# EAGLE design HeatpumpMonitor (EAGLE 6.5.0)
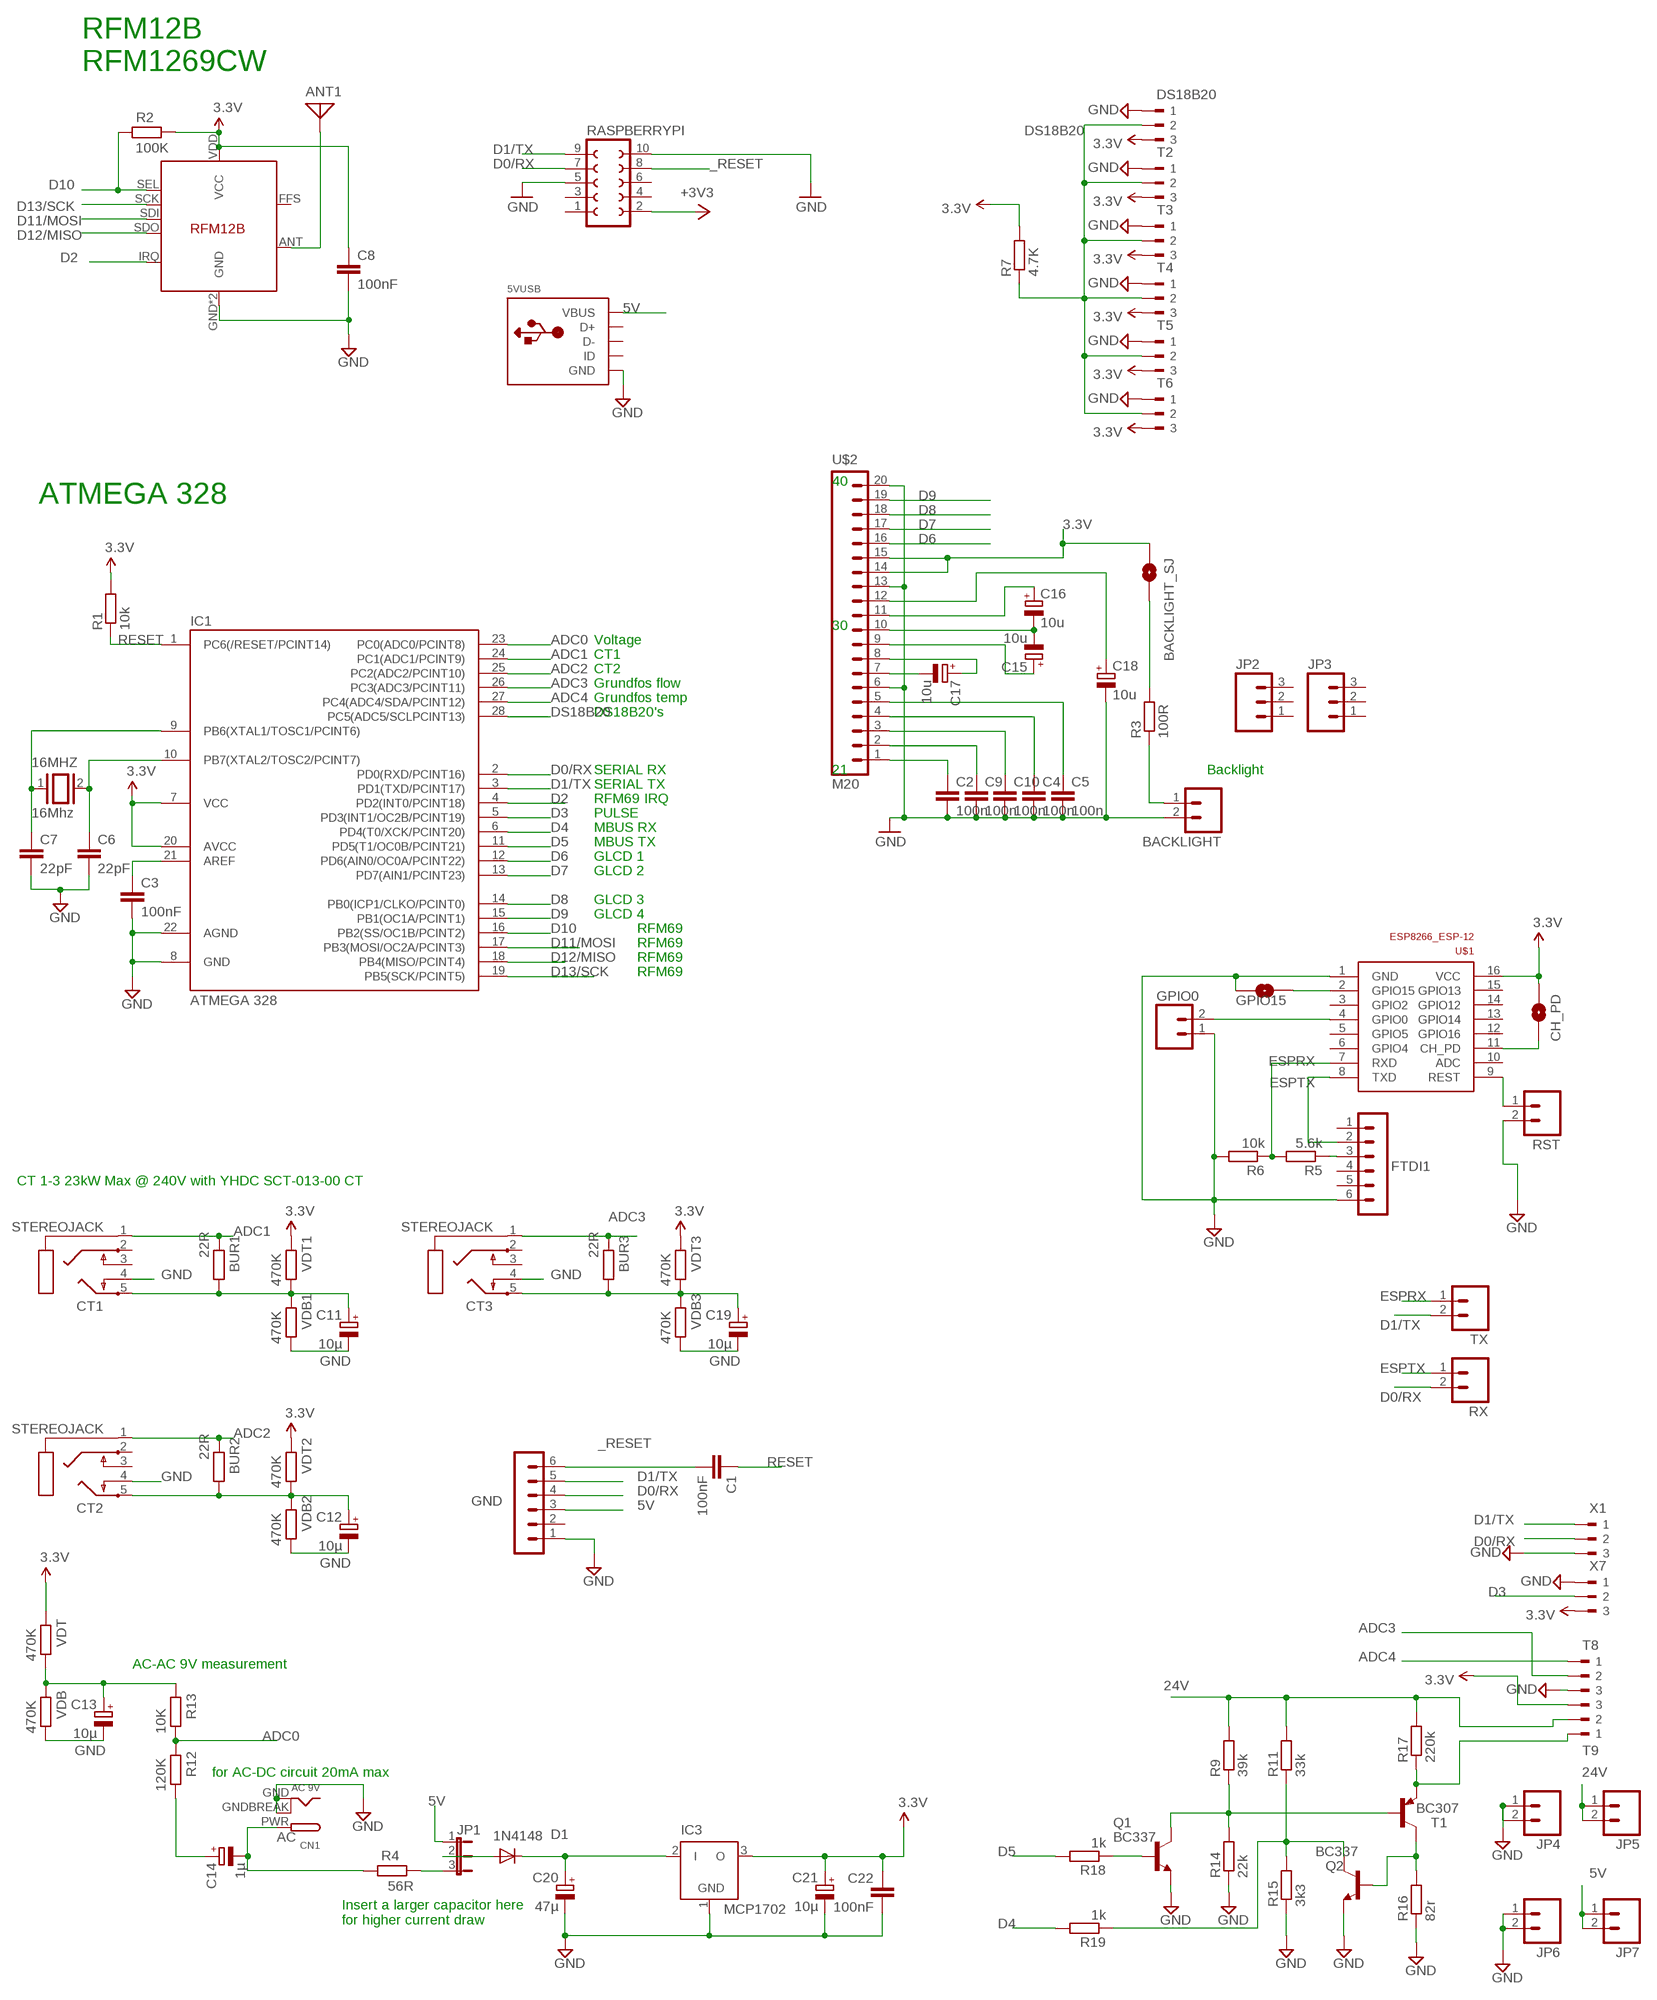
[diagram p0: schematic, sheet 1]

## Parts
5VUSB  USBMOLEX  [USB-MINIB-THM-MOLEX]
16MHZ  16Mhz  XTAL/S  [QS]
ANT1  ANTENNA  [PAD-01]
BACKLIGHT  M02PTH  [1X02]
BACKLIGHT_SJ  SOLDERJUMPERNO  [SJ_2S-NO]
BUR1  22R  R-EU_0204/7  [0204/7]
BUR2  22R  R-EU_0204/7  [0204/7]
BUR3  22R  R-EU_0204/7  [0204/7]
C1  100nF  C-EU025-024X044  [C025-024X044]
C2  100n  C2.5/2  [C2.5-2]
C3  100nF  C-EU025-024X044  [C025-024X044]
C4  100n  C2.5/2  [C2.5-2]
C5  100n  C2.5/2  [C2.5-2]
C6  22pF  C2.5/2  [C2.5-2]
C7  22pF  C2.5/2  [C2.5-2]
C8  100nF  C-EU025-024X044  [C025-024X044]
C9  100n  C2.5/2  [C2.5-2]
C10  100n  C2.5/2  [C2.5-2]
C11  10µ  CPOL-EUE1.8-4  [E1,8-4]
C12  10µ  CPOL-EUE1.8-4  [E1,8-4]
C13  10µ  CPOL-EUE1.8-4  [E1,8-4]
C14  1µ  CPOL-EUE1.8-4  [E1,8-4]
C15  10u  CPOL-EUE1.8-4  [E1,8-4]
C16  10u  CPOL-EUE1.8-4  [E1,8-4]
C17  10u  CPOL-EUE1.8-4  [E1,8-4]
C18  10u  CPOL-EUE1.8-4  [E1,8-4]
C19  10µ  CPOL-EUE1.8-4  [E1,8-4]
C20  47µ  CPOL-EUE1.8-4  [E1,8-4]
C21  10µ  CPOL-EUE1.8-4  [E1,8-4]
C22  100nF  C-EU025-024X044  [C025-024X044]
CH_PD  SOLDERJUMPERNO  [SJ_2S-NO]
CN1  AC 9V  DCBARRELPTH  [DCJACK_2MM_PTH]
CT1  STEREOJACK  [STX3100]
CT2  STEREOJACK  [STX3100]
CT3  STEREOJACK  [STX3100]
D1  1N4148  DIODE1N4148  [DIODE-1N4148]
DS18B20  180-3  [180-3]
FTDI1  FTDI  MA06-1  [MA06-1]
GND  FTDI  MA06-1  [MA06-1]
GPIO0  M02PTH  [1X02]
GPIO15  SOLDERJUMPERNO  [SJ_2S-NO]
IC1  ATMEGA 328  ATMEGA48/88/168-PU  [DIL28-3]
IC3  MCP1702  MCP1702Z  [TO92]
JP1  JP2E  [JP2]
JP2  M03PTH  [1X03]
JP3  M03PTH  [1X03]
JP4  M02PTH  [1X02]
JP5  M02PTH  [1X02]
JP6  M02PTH  [1X02]
JP7  M02PTH  [1X02]
Q1  BC337  [TO92]
Q2  BC337  [TO92]
R1  10k  R-EU_0204/7  [0204/7]
R2  100K  R-EU_0204/7  [0204/7]
R3  100R  R-EU_0204/7  [0204/7]
R4  56R  R-EU_0204/7  [0204/7]
R5  5.6k  R-EU_0204/7  [0204/7]
R6  10k  R-EU_0204/7  [0204/7]
R7  4.7K  R-EU_0204/7  [0204/7]
R9  39k  R-EU_0204/7  [0204/7]
R11  33k  R-EU_0204/7  [0204/7]
R12  120K  R-EU_0204/7  [0204/7]
R13  10K  R-EU_0204/7  [0204/7]
R14  22k  R-EU_0204/7  [0204/7]
R15  3k3  R-EU_0204/7  [0204/7]
R16  82r  R-EU_0204/7  [0204/7]
R17  220k  R-EU_0204/7  [0204/7]
R18  1k  R-EU_0204/7  [0204/7]
R19  1k  R-EU_0204/7  [0204/7]
RASPBERRYPI  FE05-2  [FE05-2]
RST  M02PTH  [1X02]
RX  M02PTH  [1X02]
T1  BC307  [TO92]
T2  180-3  [180-3]
T3  180-3  [180-3]
T4  180-3  [180-3]
T5  180-3  [180-3]
T6  180-3  [180-3]
T8  180-3  [180-3]
T9  180-3  [180-3]
TX  M02PTH  [1X02]
U$1  ESP8266_ESP-12  [ESP8266-ESP12]
U$2  M20  [1X20]
U$14  RFM12B  [RFM12B]
VDB  470K  R-EU_0204/7  [0204/7]
VDB1  470K  R-EU_0204/7  [0204/7]
VDB2  470K  R-EU_0204/7  [0204/7]
VDB3  470K  R-EU_0204/7  [0204/7]
VDT  470K  R-EU_0204/7  [0204/7]
VDT1  470K  R-EU_0204/7  [0204/7]
VDT2  470K  R-EU_0204/7  [0204/7]
VDT3  470K  R-EU_0204/7  [0204/7]
X1  180-3  [180-3]
X7  180-3  [180-3]

## Nets
3.3V: BACKLIGHT_SJ.1 C8.1 C21.+ C22.1 CH_PD.2 DS18B20.3 IC1.7(VCC) IC1.20(AVCC) IC3.3(O) R1.2 R2.1 R7.2 RASPBERRYPI.2 T2.3 T3.3 T4.3 T5.3 T6.3 T9.3 U$1.16(VCC) U$2.14 U$2.15 U$14.VDD(VCC) VDT1.2 VDT2.2 VDT3.2 VDT.2 X7.3 ; supply symbol labelled +3V3
5V [power]: 5VUSB.VBUS GND.3 JP1.1 JP7.1 JP7.2
24V: JP5.1 JP5.2 R9.2 R11.2 R17.2 T9.2
_RESET: C1.2 GND.6 RASPBERRYPI.8
AC: C14.- CN1.PWR R4.2
ADC0: IC1.23(PC0(ADC0/PCINT8)) R12.2 R13.1
ADC1: BUR1.2 CT1.1 IC1.24(PC1(ADC1/PCINT9))
ADC2: BUR2.2 CT2.1 IC1.25(PC2(ADC2/PCINT10))
ADC3: BUR3.2 CT3.1 IC1.26(PC3(ADC3/PCINT11)) T8.2
ADC4: IC1.27(PC4(ADC4/SDA/PCINT12)) T8.1
D0/RX: GND.4 IC1.2(PD0(RXD/PCINT16)) RASPBERRYPI.7 RX.2 X1.2
D1/TX: GND.5 IC1.3(PD1(TXD/PCINT17)) RASPBERRYPI.9 TX.2 X1.1
D2: IC1.4(PD2(INT0/PCINT18)) U$14.IRQ
D3: IC1.5(PD3(INT1/OC2B/PCINT19)) X7.2
D4: IC1.6(PD4(T0/XCK/PCINT20)) R19.2
D5: IC1.11(PD5(T1/OC0B/PCINT21)) R18.2
D6: IC1.12(PD6(AIN0/OC0A/PCINT22)) U$2.16
D7: IC1.13(PD7(AIN1/PCINT23)) U$2.17
D8: IC1.14(PB0(ICP1/CLKO/PCINT0)) U$2.18
D9: IC1.15(PB1(OC1A/PCINT1)) U$2.19
D10: IC1.16(PB2(SS/OC1B/PCINT2)) R2.2 U$14.SEL
D11/MOSI: IC1.17(PB3(MOSI/OC2A/PCINT3)) U$14.SDI
D12/MISO: IC1.18(PB4(MISO/PCINT4)) U$14.SDO
D13/SCK: IC1.19(PB5(SCK/PCINT5)) U$14.SCK
DIG1: ANT1.1 U$14.ANT
DS18B20: DS18B20.2 IC1.28(PC5(ADC5/SCLPCINT13)) R7.1 T2.2 T3.2 T4.2 T5.2 T6.2
ESPRX: R5.2 R6.1 TX.1 U$1.7(RXD)
ESPTX: FTDI1.2 RX.1 U$1.8(TXD)
GND [power]: 5VUSB.GND BACKLIGHT.2 C2.2 C3.2 C4.2 C5.2 C6.2 C7.2 C8.2 C9.2 C10.2 C11.- C12.- C13.- C18.- C19.- C20.- C21.- C22.2 CN1.GND CN1.GNDBREAK CT1.4 CT2.4 CT3.4 DS18B20.1 FTDI1.6 GND.1 GPIO0.1 GPIO15.2 IC1.8(GND) IC1.22(AGND) IC3.1(GND) JP4.1 JP4.2 JP6.1 JP6.2 Q1.1(E) Q2.1(E) R6.2 R14.1 R15.1 R16.1 RASPBERRYPI.5 RASPBERRYPI.10 RST.2 T2.1 T3.1 T4.1 T5.1 T6.1 T8.3 U$1.1(GND) U$2.6 U$2.13 U$2.20 U$14.GND U$14.P$12(GND) VDB1.1 VDB2.1 VDB3.1 VDB.1 X1.3 X7.1
IRQ: BACKLIGHT_SJ.2 R3.2
N$1: 16MHZ.2 C6.1 IC1.10(PB7(XTAL2/TOSC2/PCINT7))
N$2: BUR2.1 C12.+ CT2.5 VDB2.2 VDT2.1
N$3: C2.1 U$2.1
N$4: C9.1 U$2.2
N$5: C10.1 U$2.3
N$6: C4.1 U$2.4
N$7: C14.+ R12.1
N$8: BUR3.1 C19.+ CT3.5 VDB3.2 VDT3.1
N$9: C5.1 U$2.5
N$10: C15.- C16.- U$2.10
N$11: C20.+ D1.C IC3.2(I)
N$12: 16MHZ.1 C7.1 IC1.9(PB6(XTAL1/TOSC1/PCINT6))
N$13: R17.1 T1.1(E) T9.1
N$14: JP1.3 R4.1
N$16: Q2.2(B) R16.2 T1.3(C)
N$17: BACKLIGHT.1 R3.1
N$18: Q1.3(C) R9.1 R14.2 T1.2(B)
N$19: C3.1 IC1.21(AREF)
N$20: C16.+ U$2.11
N$21: Q2.3(C) R11.1 R15.2 R19.1
N$22: C15.+ U$2.9
N$23: C17.- U$2.7
N$24: D1.A JP1.2
N$25: Q1.2(B) R18.1
N$26: GPIO15.1 U$1.2(GPIO15)
N$27: C17.+ U$2.8
N$28: C18.+ U$2.12
N$29: GPIO0.2 U$1.4(GPIO0)
N$34: C13.+ R13.2 VDB.2 VDT.1
N$36: FTDI1.3 R5.1
N$38: BUR1.1 C11.+ CT1.5 VDB1.2 VDT1.1
N$39: CH_PD.1 U$1.11(CH_PD)
N$40: RST.1 U$1.9(REST)
RESET: C1.1 IC1.1(PC6(/RESET/PCINT14)) R1.1
Unconnected: 5VUSB.D+ 5VUSB.D- 5VUSB.ID CT1.2 CT1.3 CT2.2 CT2.3 CT3.2 CT3.3 FTDI1.1 FTDI1.4 FTDI1.5 GND.2 JP2.1 JP2.2 JP2.3 JP3.1 JP3.2 JP3.3 RASPBERRYPI.1 RASPBERRYPI.3 RASPBERRYPI.4 RASPBERRYPI.6 U$1.3(GPIO2) U$1.5(GPIO5) U$1.6(GPIO4) U$1.10(ADC) U$1.12(GPIO16) U$1.13(GPIO14) U$1.14(GPIO12) U$1.15(GPIO13) U$14.FFS

## Notes on the sheet
- RFM12B
  RFM1269CW
- 40
- ATMEGA 328
- 30
- Voltage
- CT1
- CT2
- Grundfos flow
- Grundfos temp
- DS18B20's
- SERIAL RX | 21 | Backlight
- SERIAL TX
- RFM69 IRQ
- PULSE
- MBUS RX
- MBUS TX
- GLCD 1
- GLCD 2
- GLCD 3
- GLCD 4
- RFM69
- RFM69
- RFM69
- RFM69
- CT 1-3 23kW Max @ 240V with YHDC SCT-013-00 CT
- AC-AC 9V measurement
- for AC-DC circuit 20mA max
- Insert a larger capacitor here
  for higher current draw

## Library data of the parts
5VUSB = adafruit:USB: USB Connectors USBMINIB - Surface Mount Female Mini-B USB Connector 4UConnector: 06564 By microbuilder.eu Thru-hole RA Female Mini-B USB Connector 4UConnector: 18732 By ladyada.net
16MHZ = special:XTAL/S: CRYSTAL
ANT1 = discrete:ANTENNA: Antenna
BACKLIGHT GPIO0 JP4-JP7 RST RX TX = SparkFun:M02: Header 2 Standard 2-pin 0.1" header. Use with straight break away headers (SKU : PRT-00116), right angle break away headers (PRT-00553), swiss pins (PRT-00743), machine pins (PRT-00117), and female headers (PRT-00115). Molex polarized connector foot print use with SKU : PRT-08233 with associated crimp pins and housings.
BACKLIGHT_SJ CH_PD GPIO15 = SparkFun:SOLDERJUMPER: Solder Jumper Standard SMD solder jumper. Used to automate production. Two varients : Normally Open and Normally Closed are the same, but have different paste layers. NC will have a large amount of paste and should jumper during reflow.
BUR1-BUR3 R2-R6 R12 R13 VDB VDB1-VDB3 VDT VDT1-VDT3 = rcl:R-EU_: RESISTOR, European symbol
C1 C3 C8 C22 = resistor:C-EU: CAPACITOR, European symbol
C2 C4-C7 C9 C10 = capacitor-wima:C: CAPACITOR naming: grid - package width
C11-C21 = resistor:CPOL-EU: POLARIZED CAPACITOR, European symbol
CN1 = adafruit:DCBARREL: 2.0mm DC Barrel Jack DCJACK_2MM_PTH - Through Hole Jack (4UConnector: 05537)
CT1-CT3 = adafruit:STEREOJACK: MIC/HEADPHONE JACK Stereo jack with two switches. Kycon STX3100, CUI SJ1-3555NG and/or 4UCon 05544
D1 = SparkFun:DIODE: Diode These are standard reverse protection diodes and small signal diodes. SMA package can handle up to about 1A. SOD-323 can handle about 200mA. What the SOD-323 package when ordering, there are some mfgs out there that are 5-pin packages.
DS18B20 T2-T6 T8 T9 X1 X7 = con-weidmueller-sl35:180-3: WEIDMUELLER CLAMP CONNECTOR; OC_FARNELL: unknown; OC_NEWARK: unknown
FTDI1 GND = JeeLabs:MA06-1: PIN HEADER
IC1 = atmega8:ATMEGA48/88/168-PU
IC3 = JeeLabs:MCP1702: 200 mA, Low Power Low Dropout Voltage Regulator
JP1 = jumper:JP2E: JUMPER
JP2 JP3 = SparkFun:M03: Header 3 Standard 3-pin 0.1" header. Use with straight break away headers (SKU : PRT-00116), right angle break away headers (PRT-00553), swiss pins (PRT-00743), machine pins (PRT-00117), and female headers (PRT-00115). Molex polarized connector foot print use with SKU : PRT-08232 with associated crimp pins and housings.
Q1 Q2 = transistor:BC337: NPN TRANSISTOR
R1 R7 R9 R11 R14-R19 = resistor:R-EU_: RESISTOR, European symbol
RASPBERRYPI = con-lsta:FE05-2: FEMALE HEADER; OC_FARNELL: unknown; OC_NEWARK: unknown
T1 = transistor-pnp:BC307: PNP Transistor
U$1 = ESP8266-ESP12:ESP8266_ESP-12
U$2 = SparkFun:M20: This is just like the LOCK variant in that the holes are staggared by 5 mil, but except for the last two holes. They are not altered from the "standard" footprint layout. This is used for a special purpose on the layout of our Graphic LCD Backpack. Make sure you want to use this device before selecting it for you project!
U$14 = JeeParts:RFM12B

## Net classes
0 default: width 0.203 mm, drill 0.6 mm, clearance 0.203 mm
1 power: width 0.381 mm, drill 0.6 mm, clearance 0.254 mm
2 gnd: width 0.254 mm, drill 0.6 mm, clearance 0.254 mm

## Board
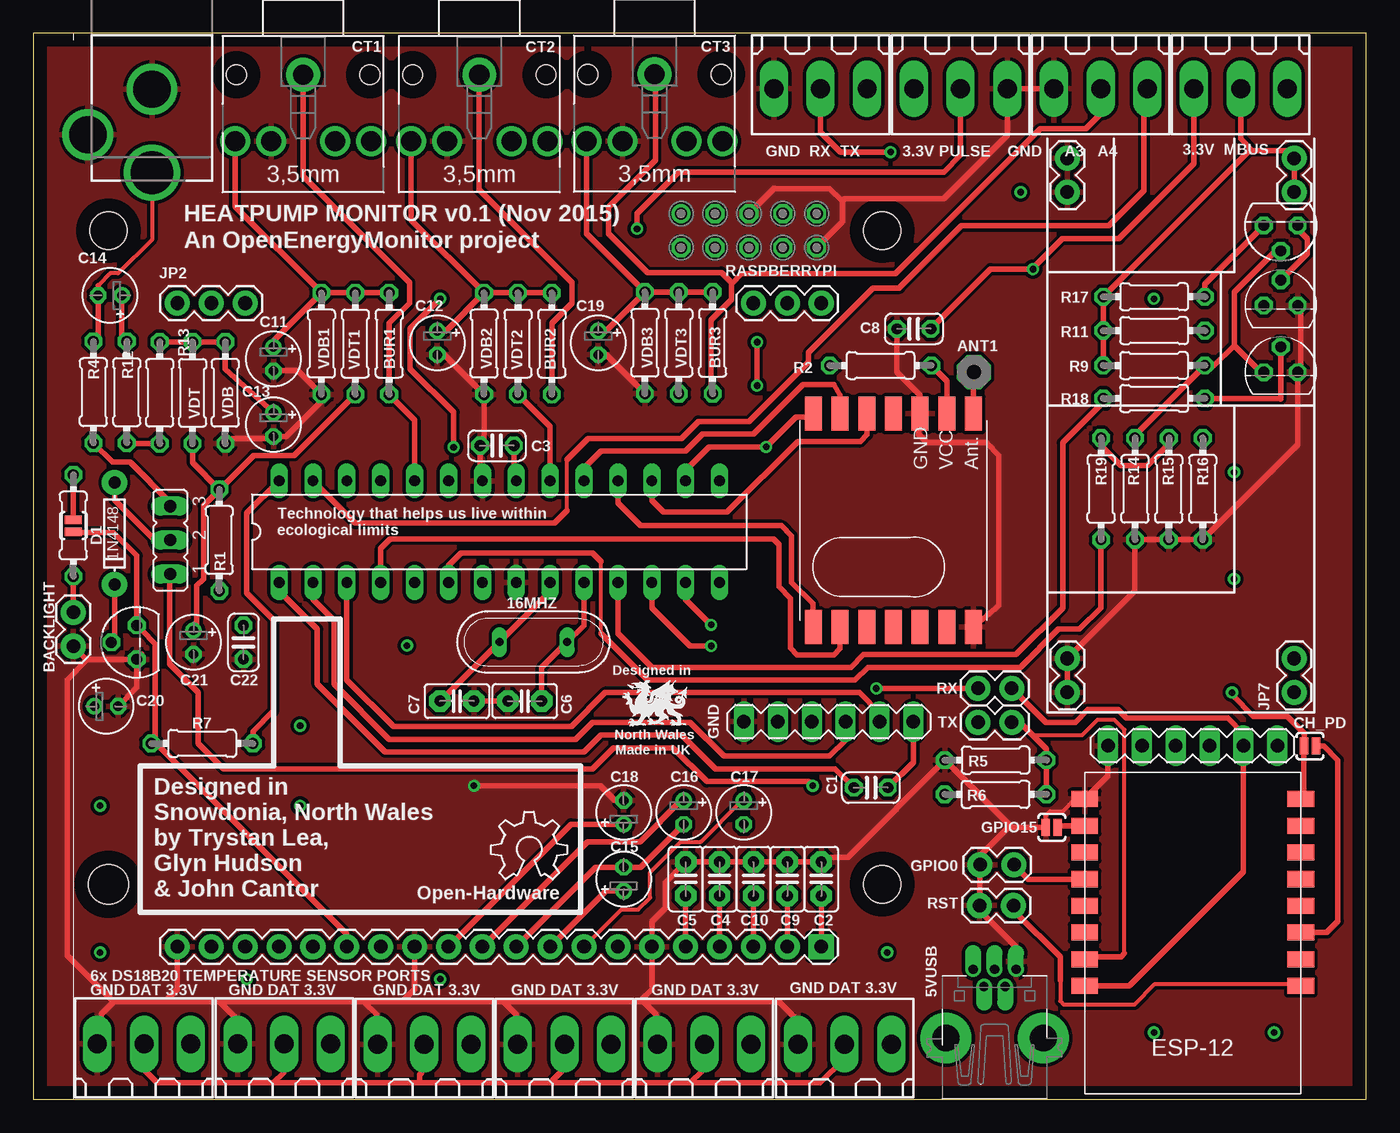
[diagram p1: board, top side]
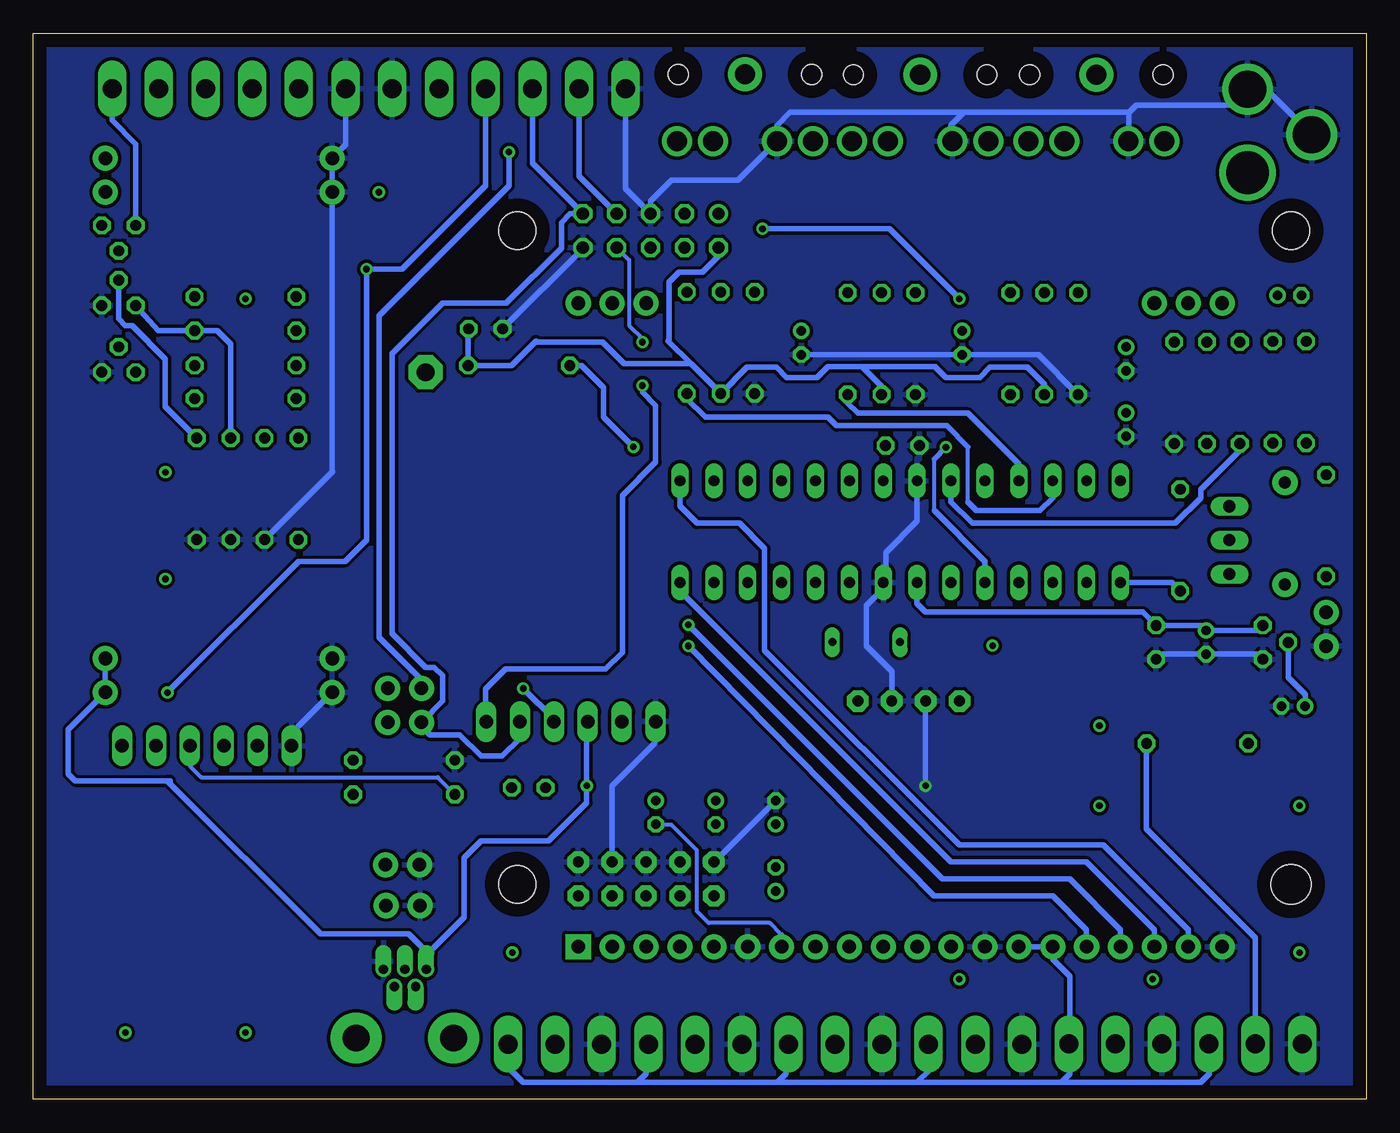
[diagram p2: board, bottom side, seen from below]

Size 99.9 x 79.9 mm. Coordinates in mm from the lower left corner, seen from the top.
Outline: 99.9,0 99.9,79.9 0,79.9 0,0 99.9,0
Copper layers (1*16): Top 0.035mm / dielectric 1.5mm / Bottom 0.035mm
Design rules "default *": minimum track width 10mil, minimum drill 24mil, track to track 8mil, track to pad 8mil, pad to pad 8mil, via to via 8mil, smd to smd 8mil, copper to edge 40mil, drill to drill 8mil, minimum pad ring 10mil, minimum via ring 8mil, stop-mask expansion 0.075mm, vias tented up to drill 0.6mm, thermal gap 10mil
Holes 2.8 mm at 63.63,16.11 63.63,65.11 5.63,65.11
Holes 3 mm at 5.63,16.11

### Footprints (pad centres in the part's own frame; a part is rotated, then mirrored left to right if it is on the bottom)
USB-MINIB-THM-MOLEX = drill 0.7 offset: D+ 0,9.72; D- -0.8,8.42; GND 1.6,9.72; ID 0.8,8.42; VBUS -1.6,9.72 | drill 2 pad 3.81: GND1 -3.65,4.57; GND4 3.65,4.57
QS = drill 0.61 long: 1 -2.54,0; 2 2.54,0
PAD-01 = drill 1.321 pad 2.54 octagon: 1 0,0
1X02 = drill 1.016 pad 1.88: 1 0,0; 2 2.54,0
SJ_2S-NO = smd 0.635 x 1.27: 1 -0.45,0; 2 0.45,0
0204/7 = drill 0.813 octagon: 1 -3.81,0; 2 3.81,0
C025-024X044 = drill 0.813 octagon: 1 -1.27,0; 2 1.27,0
C2.5-2 = drill 0.813 pad 1.6 octagon: 1 -1.27,0; 2 1.27,0
E1,8-4 = drill 0.711 pad 1.168: + -0.889,0 | drill 0.711 pad 1.168 octagon: - 0.889,0
DCJACK_2MM_PTH = drill 2.8: GND 0,7.35; GNDBREAK 4.8,10.75 | drill 3.2: PWR 0,13.6
STX3100 = drill 1.5 pad 2.54: 1 2.7,-0.1 | drill 1.5: 2 7.7,5; 3 7.7,2.3; 4 7.7,-2.5; 5 7.7,-5.2 | hole 1.5: 2.7,4.9; 2.7,-5.1
DIODE-1N4148 = drill 0.9 pad 1.88: A -3.81,0; C 3.81,0
180-3 = drill 1.422 long: 1 -3.5,0; 2 0,0; 3 3.5,0
MA06-1 = drill 1.016 long: 1 0,0; 2 2.54,0; 3 5.08,0; 4 7.62,0; 5 10.16,0; 6 12.7,0
DIL28-3 = drill 0.813 long: 1 -16.51,-3.81; 2 -13.97,-3.81; 3 -11.43,-3.81; 4 -8.89,-3.81; 5 -6.35,-3.81; 6 -3.81,-3.81; 7 -1.27,-3.81; 8 1.27,-3.81; 9 3.81,-3.81; 10 6.35,-3.81; 11 8.89,-3.81; 12 11.43,-3.81; 13 13.97,-3.81; 14 16.51,-3.81; 15 16.51,3.81; 16 13.97,3.81; 17 11.43,3.81; 18 8.89,3.81; 19 6.35,3.81; 20 3.81,3.81; 21 1.27,3.81; 22 -1.27,3.81; 23 -3.81,3.81; 24 -6.35,3.81; 25 -8.89,3.81; 26 -11.43,3.81; 27 -13.97,3.81; 28 -16.51,3.81
TO92 = drill 0.813 octagon: 1 -1.27,0; 2 0,1.905; 3 1.27,0
JP2 = drill 0.914 long: 1 -2.54,0; 2 0,0; 3 2.54,0
1X03 = drill 1.016 pad 1.88: 1 0,0; 2 2.54,0; 3 5.08,0
TO92' = drill 0.813 octagon: 1 1.27,0; 2 0,1.905; 3 -1.27,0
FE05-2 = drill 0.914: 1 -5.08,1.27 | drill 0.914 octagon: 2 -5.08,-1.27; 3 -2.54,1.27; 4 -2.54,-1.27; 5 0,1.27; 6 0,-1.27; 7 2.54,1.27; 8 2.54,-1.27; 9 5.08,1.27; 10 5.08,-1.27
ESP8266-ESP12 = smd 2 x 1.2: 1 16.2,2; 2 16.2,4; 3 16.2,6; 4 16.2,8; 5 16.2,10; 6 16.2,12; 7 16.2,14; 8 16.2,16; 9 0,16; 10 0,14; 11 0,12; 12 0,10; 13 0,8; 14 0,6; 15 0,4; 16 0,2
1X20 = drill 1.016 pad 1.88 square: 1 0,0 | drill 1.016 pad 1.88: 2 2.54,0; 3 5.08,0; 4 7.62,0; 5 10.16,0; 6 12.7,0; 7 15.24,0; 8 17.78,0; 9 20.32,0; 10 22.86,0; 11 25.4,0; 12 27.94,0; 13 30.48,0; 14 33.02,0; 15 35.56,0; 16 38.1,0; 17 40.64,0; 18 43.18,0; 19 45.72,0; 20 48.26,0
RFM12B = smd 2.54 x 1.27: ANT 8,-6; FFS -8,2; GND 8,-2; IRQ -8,4; P$8 -8,0; P$9 -8,-2; P$10 -8,-4; P$12 -8,-6; P$16 8,0; SCK 8,4; SDI 8,2; SDO -8,6; SEL 8,6; VDD 8,-4

### Placement (x,y rotation side)
5VUSB  72.05,0.02 0 top
16MHZ  37.48,34.27 0 top
ANT1  70.5,54.5 270 top
BACKLIGHT  3,36.5 270 top
BACKLIGHT_SJ  3,43 90 top
BUR1  26.67,56.64 270 top
BUR2  38.86,56.64 270 top
BUR3  50.91,56.7 270 top
C1  62.78,23.36 0 top
C2  59.05,16.51 90 top
C3  34.75,49 180 top
C4  51.44,16.51 90 top
C5  48.9,16.51 90 top
C6  36.83,29.84 180 top
C7  31.75,29.84 0 top
C8  66,57.75 180 top
C9  56.52,16.51 90 top
C10  53.98,16.51 90 top
C11  18,55.5 270 top
C12  30.28,56.7 270 top
C13  18,50.57 270 top
C14  5.75,60.25 180 top
C15  44.25,16.5 90 top
C16  48.75,21.5 270 top
C17  53.25,21.5 270 top
C18  44.25,21.5 90 top
C19  42.34,56.7 270 top
C20  5.46,29.46 0 top
C21  12,34.25 270 top
C22  15.75,34.25 270 top
CH_PD  95.69,26.47 180 top
CN1  8.89,83.06 180 top
CT1  20.32,79.5 270 top
CT2  33.53,79.5 270 top
CT3  46.66,79.53 270 top
D1  6.08,42.41 270 top
DS18B20  8.3,4.15 0 top
FTDI1  93.25,26.5 180 top
GND  53.26,28.3 0 top
GPIO0  70.96,17.58 0 top
GPIO15  76.34,20.38 180 top
IC1  34.92,42.55 0 top
IC3  7.75,34.25 90 top
JP1  10.26,41.91 90 top
JP2  10.79,59.68 0 top
JP3  53.98,59.68 0 top
JP4  77.5,68 90 top
JP5  94.5,68 90 top
JP6  77.5,30.5 90 top
JP7  94.5,30.5 90 top
LOGO1  OSHW_LOGO_6MILX0200-NT  [OSHW_6X200_NOTEXT]  34.33,16.47 0 top
Q1  BC337  [TO92']  93.5,54.5 0 top
Q2  BC337  [TO92']  93.5,59.5 0 top
R1  13.94,41.91 90 top
R2  63.5,55 180 top
R3  3,43 90 top
R4  4.5,53 90 top
R5  72.12,22.85 0 top
R6  72.12,25.42 180 top
R7  12.65,26.67 180 top
R9  84,55 180 top
R11  84,57.62 180 top
R12  7,53 270 top
R13  9.47,52.95 90 top
R14  82.58,45.76 90 top
R15  85.11,45.76 90 top
R16  87.66,45.76 90 top
R17  84,60.16 180 top
R18  84,52.53 180 top
R19  80.03,45.76 270 top
RASPBERRYPI  53.63,65.11 0 top
RST  73.46,14.52 180 top
RX  73.34,30.8 180 top
T1  BC307  [TO92']  93.5,65.5 180 top
T2  18.8,4.15 0 top
T3  29.3,4.13 0 top
T4  39.8,4.13 0 top
T5  50.3,4.13 0 top
T6  60.8,4.13 0 top
T8  80,75.75 180 top
T9  90.5,75.75 180 top
TX  73.34,28.26 180 top
U$1  95,24.5 180 top
U$2  59.05,11.43 180 top
U$14  64.47,43.39 90 top
VDB  14.39,52.95 90 top
VDB1  21.59,56.64 90 top
VDB2  33.78,56.64 90 top
VDB3  45.84,56.7 90 top
VDT  11.93,52.95 270 top
VDT1  24.13,56.64 270 top
VDT2  36.32,56.64 270 top
VDT3  48.38,56.7 270 top
X1  59,75.75 180 top
X7  69.5,75.75 180 top

### Tracks (layer width: path | path; a pad name or v marks a point on that pad's centre or on a via)
3.3V  (via drill 0.5)
  Top 0.406: 94.74,22.61 95,22.61 U$1.16 arc90 U$1.16 95.24,22.74 CH_PD.2 95.25,26.49 95.25,27.43 93.98,28.7 91.44,28.7 89.85,30.29 v89.85,30.48 | BACKLIGHT_SJ.1 3.05,42.5 6,42.5 7.75,40.75 IC3.3 8.13,35.14 8.14,35.14 9.14,34.14 9.14,26.98 R7.2 9.21,26.67 23.5,12.38 U$2.15 | R1.2 11.93,47.73 VDT.2 | R1.2 13.97,45.75 14,45.75 12.75,44.5 12.75,39 12.25,38.5 12.25,35.39 C21.+ | VDT2.2 38.73,50.42 IC1.20 | R2.1 68.47,53.84 U$14.VDD 68.54,51.08 68.58,51.12 | VDT1.2 19.56,48.26 16.51,48.26 13.97,45.72 R1.2 | C8.1 71.75,62.23 v74.93,62.23 74.93,62.3 77.12,64.5 81.38,64.5 87,70.12 T9.3
  Bottom 0.406: VDT1.2 24.13,53.59 25.4,54.86 28.19,54.86 28.96,54.1 31.5,54.1 32.32,54.93 37.78,54.93 | U$2.14 U$2.15 23.5,10.48 22.23,9.21 22.23,4.22 T2.3 22.23,4.08 22.23,1.91 22.86,1.27 | DS18B20.3 11.75,4.1 11.75,1.91 12.38,1.27 22.86,1.27 | 22.86,1.27 33.66,1.27 | 33.66,1.27 44.13,1.27 | 44.13,1.27 54.61,1.27 | 54.61,1.27 63.18,1.27 64.14,2.22 64.14,3.96 T6.3 | T3.3 32.7,4.03 32.7,2.22 33.66,1.27 | T4.3 43.5,3.93 43.5,1.91 44.13,1.27 | T5.3 53.98,3.96 53.98,1.91 54.61,1.27 | 37.78,54.93 40.32,54.93 41.15,54.1 43.43,54.1 44.2,54.86 46.41,54.86 VDT3.2 50.62,55.13 | 37.78,54.93 36.32,53.47 VDT2.2 | 50.62,55.13 52.31,56.83 52.25,56.9 52.25,61.25 51.5,62 49.75,62 48.55,63.2 RASPBERRYPI.2 | C8.1 67.31,57.71 R2.1 64.06,55 62.23,56.83 62.15,56.75 57.25,56.75 55.63,55.13 50.62,55.13 | v89.85,30.48 80.01,40.32 76.52,40.32 74.93,41.91 v74.93,62.23 72.25,62.23 66,68.48 X7.3 | IC1.7 33.66,37.15 33.02,36.51 16.74,36.51 C22.1 12.38,35.52 C21.+ 8.13,35.14 IC3.3
5V  (via drill 0.5)
  Top 0.406: v58.42,23.5 58.1,23.81 50.48,23.81 47.94,26.35 43.5,26.35 41.91,24.77 14.25,24.77 12.34,26.67 12.34,30.48 10.21,32.61 10.21,39.33 JP1.1
  Bottom 0.406: 89.85,23.88 96.77,23.88 97.28,24.38 97.28,27.72 JP7.1 JP7.2 | 89.85,23.88 89.66,23.88 | JP1.1 10.16,39.27 | GND.3 58.42,28.23 v58.42,23.5 58.42,22.23 61.28,19.37 66.36,19.37 67.63,18.1 67.63,13.62 70.45,10.79 | 70.45,10.79 70.45,11.08 71.75,12.38 78.36,12.38 89.85,23.88 | 70.45,10.79 5VUSB.VBUS
24V
  Top 0.406: R9.2 R11.2 R17.2 91.16,71.11 91.38,71.11 | JP5.1 JP5.2 93.92,71.11 91.38,71.11 | 91.38,71.11 90.5,71.99 T9.2
_RESET  (via drill 0.5)
  Top 0.406: GND.6 65.95,25.26 C1.2 | v54.25,53.5 v54.25,56.75
  Bottom 0.305: RASPBERRYPI.8 55.25,62.91 55.25,58 54.25,57
  Bottom 0.406: GND.6 66,28.34 66,30.75 64.5,32.25 57,32.25 55.75,33.5 55.75,45.25 53.25,47.75 53.25,52 54.25,53 v54.25,53.5 | 54.25,57 v54.25,56.75
AC
  Top 0.305: CN1.PWR 8.89,64.45 6.35,61.91 5.78,61.91 4.86,60.99
  Top 0.406: 4.86,60.99 C14.- 4.86,57.17 R4.2
ADC0
  Top 0.406: R12.2 7.04,49.15 R13.1 9.39,49.15 9.25,49
  Bottom 0.406: R13.1 9.53,49.09 9.53,48.58 12.38,45.72 12.38,45.09 14.29,43.18 29.53,43.18 31.11,44.77 IC1.23 31.11,45.4
ADC1
  Top 0.406: CT1.1 20.22,69.19 28.19,61.21 28.19,59.69 26.67,58.17 BUR1.2 28.57,50.93 IC1.24
ADC2
  Top 0.406: BUR2.2 38.86,58.17 40.39,59.69 40.39,61.21 33.43,68.17 CT2.1
  Bottom 0.406: IC1.25 26.04,47.62 29.84,51.44 38.1,51.44 38.86,52.2 BUR2.2 38.86,52.51
ADC3
  Top 0.406: 52.32,61.11 52.32,61.21 51.56,61.98 46.02,61.98 43.12,64.88 43.12,66.88 46.62,70.38 46.62,76.76 CT3.1 46.66,76.83 | 52.32,61.11 52.32,59.94 50.8,58.42 50.8,53.01 BUR3.2 | 52.32,61.11 53.09,61.87 64.62,61.87 75.49,72.75 78.88,72.75 80,73.88 T8.2
  Bottom 0.305: 29.84,44.77 29.84,48.9
  Bottom 0.406: IC1.26 23.5,45.09 24.45,44.13 29.21,44.13 29.84,44.77 | 29.84,48.9 31.43,50.48 39.69,50.48 40.32,51.12 49.53,51.12 50.91,52.5 BUR3.2
ADC4
  Top 0.305: 40.01,44.13 40.01,47.94
  Top 0.406: IC1.27 24.13,43.18 39.05,43.18 40.01,44.13 | 40.01,47.94 41.59,49.53 48.58,49.53 49.85,50.8 53.66,50.8 58.1,55.24 58.1,55.97 62.94,60.81 64.88,60.81 | 64.88,60.81 64.92,60.81 | 64.88,60.81 69.57,65.5 80.62,65.5 83.25,68.12 83.25,74.89 83.5,75.14 T8.1
D0/RX  (via drill 0.5)
  Top 0.406: IC1.2 20.95,37.47 22.54,35.88 22.54,31.11 26.67,26.99 40.64,26.99 41.91,28.26 49.21,28.26 51.75,25.72 59.69,25.72 60.88,26.91 GND.4 | RX.2 v63.18,30.8 | X1.2 59,72.5 60.5,71 v64.25,71
  Bottom 0.406: 60.88,28.82 GND.4 60.88,28.5 v63.18,30.8 | RX.2 70.8,31.43 73.98,34.61 73.98,58.74 64.25,68.47 v64.25,71 | RASPBERRYPI.7 59,69.2 X1.2
D1/TX
  Top 0.406: IC1.3 23.5,31.43 26.99,27.94 40.32,27.94 42.86,30.48 61.91,30.48 63.42,28.97 GND.5
  Bottom 0.406: GND.5 63.42,27.07 64.77,25.72 66.36,25.72 67.94,27.3 70.17,27.3 70.8,27.94 TX.2 69.22,29.84 69.22,31.75 69.85,32.38 70.48,32.38 73.03,34.92 73.03,55.88 69.22,59.69 64.45,59.69 60.33,63.82 60.33,65.72 59.67,66.38 RASPBERRYPI.9 62.5,70.17 X1.1
D2
  Top 0.406: U$14.IRQ 60.47,33.78 60,33.32 57.25,33.32 56.75,33.82 56.75,37.55 55.88,38.42 55.88,41.59 55.47,42 26.75,42 26.04,41.28 IC1.4
D3  (via drill 0.5)
  Top 0.406: v31.5,48.88 31.5,51.5 28.25,54.75 28.25,57.75 v30.5,60 | v45.25,65.25 45.25,66.38 48.38,69.5 68.25,69.5 69.5,70.75 X7.2
  Bottom 0.305: 32.38,44.12 32.38,48
  Bottom 0.406: IC1.5 28.57,40.33 32.38,44.12 | 32.38,48 v31.5,48.88 | v45.25,65.25 35.75,65.25 v30.5,60
D4
  Top 0.305: 42.55,34.92 42.55,40.32
  Top 0.406: IC1.6 31.11,40.01 32.07,40.96 41.91,40.96 42.55,40.32 | R19.2 80.01,41.92 80.01,36.83 78.42,35.24 76.83,35.24 73.98,32.38 62.55,32.38 61.59,31.43 46.04,31.43 42.55,34.92
D5
  Top 0.406: 80.5,52.5 80.23,52.5 R18.2 80.19,52.26 77.15,49.21 77.15,36.83 73.66,33.34 62.23,33.34 61.28,32.38 46.35,32.38 43.81,34.92 IC1.11
D6  (via drill 0.5)
  Top 0.406: IC1.12 46.35,36.83 49.21,33.97 v50.8,33.97
  Bottom 0.406: U$2.16 20.95,12.7 23.5,15.24 32.38,15.24 v50.8,33.97
D7  (via drill 0.5)
  Top 0.406: IC1.13 48.9,37.47 v50.8,35.56
  Bottom 0.406: U$2.17 18.41,12.7 22.23,16.51 31.75,16.51 v50.8,35.56
D8
  Bottom 0.406: U$2.18 15.88,12.7 20.95,17.78 31.11,17.78 51.21,37.88 IC1.14
D9
  Bottom 0.406: U$2.19 13.34,12.7 19.68,19.05 30.48,19.05 45.09,33.66 45.09,41.27 46.99,43.18 50.16,43.18 51.44,44.45 IC1.15
D10  (via drill 0.5)
  Top 0.406: U$14.SEL 58.42,51.12 57.15,51.12 v54.93,48.9 50.65,48.9 48.9,47.15 IC1.16
  Bottom 0.406: 59.62,54.93 R2.2 58.81,55 57.15,53.34 57.15,51.12 v54.93,48.9
D11/MOSI
  Top 0.406: U$14.SDI 62.5,51.04 62.5,49.82 62,49.32 57.32,49.32 52,44 47.25,44 46.35,44.9 IC1.17
D12/MISO
  Top 0.406: 58.47,36.53 U$14.SDO 58.42,35.12 58.42,37.15 56.83,38.73 56.83,42.23 56.06,43 45.5,43 43.81,44.69 IC1.18
D13/SCK
  Top 0.406: U$14.SCK 60.47,52.78 60,53.57 57.7,53.57 53.98,49.85 50.16,49.85 48.9,48.58 42.55,48.58 41.27,47.31 IC1.19
DIG1
  Top 0.406: U$14.ANT 70.47,54.47 ANT1.1
DS18B20
  Top 0.406: IC1.28 16,43.94 16,37.95 17.98,35.97 17.98,29.11 16.46,27.58 R7.1 | DS18B20.2 8.38,4.07 8.38,2.13 9.3,1.22 17.98,1.22 | 17.98,1.22 28.96,1.22 | 28.96,1.22 38.86,1.22 | 38.86,1.22 49.23,1.22 | 49.23,1.22 58.98,1.22 60.8,3.04 T6.2 | T5.2 50.14,3.97 50.14,2.13 49.23,1.22 | T4.2 39.62,3.95 39.62,2.13 38.86,1.37 38.86,1.22 | T3.2 29.11,3.94 29.11,1.98 28.96,1.83 28.96,1.22 | T2.2 18.75,4.09 18.75,1.98 17.98,1.22
  Bottom 0.406: DS18B20.2 8.3,12.11 16.46,20.27 R7.1
ESPRX
  Top 0.305: 74.89,27.3 78.61,27.3 79.76,28.45 81.03,28.45 81.79,27.69 81.79,10.92
  Top 0.406: 78.15,10.5 U$1.7 78.97,10.67 81.53,10.67 81.79,10.92 | TX.1 73.93,28.26 74.89,27.3 75.93,26.26 R6.1 R5.2
ESPTX
  Top 0.406: U$1.8 82.16,8.5 90.71,17.05 FTDI1.2 90.71,27.4 89.53,28.57 81.92,28.57 81.28,29.21 79.06,29.21 78.11,28.26 75.88,28.26 RX.1
GND  (via drill 0.5)
  Top 0.305: GPIO15.2 75.89,21.27 75.88,21.27 76.2,21.59 77.15,21.59 78.11,22.54 78.76,22.54 U$1.1
  Top 0.406: Q2.1 94.77,59.23 95,59 95,54.73 Q1.1 94.77,49.06 R16.1 R15.1 R14.1 82.58,38.12 JP6.2 JP6.1 | 78.69,22.61 U$1.1 80.55,24.25 FTDI1.6 | C19.- 42.91,55.82 VDB3.1 | C12.- 30.8,55.82 VDB2.1 33.78,49.3 C3.2 | C11.- 19.81,54.61 VDB1.1 21.59,52.32 18.95,49.68 C13.- 17.85,49.53 14.92,49.53 14.54,49.15 VDB.1 14.39,49.11 14.5,49 | BACKLIGHT.2 3.98,32.98 | 3.98,32.98 IC3.1 | IC3.1 8.13,33.36 | 33.43,48.95 C3.2 | C8.2 64.73,54.52 66.47,52.78 U$14.GND 66.47,50.27 66.36,50.16 66.36,49.85 66.99,49.21 71.44,49.21 72.39,48.26 72.39,37 U$14.P$12 | C7.2 C6.2 | DS18B20.1 5.08,4.43 5.08,6.35 6.03,7.3 | 6.03,7.3 9.84,7.3 | 9.84,7.3 13.97,7.3 | 13.97,7.3 24.77,7.3 | 24.77,7.3 27.62,7.3 | 27.62,7.3 35.24,7.3 | 35.24,7.3 45.4,7.3 | 45.4,7.3 45.72,7.3 | 45.72,7.3 55.88,7.3 57.15,6.03 57.15,4.28 T6.1 | T2.1 15.24,4.21 15.24,6.03 13.97,7.3 | T3.1 25.72,4.21 25.72,6.35 24.77,7.3 | T5.1 46.67,4.26 46.67,6.35 45.72,7.3 | T4.1 36.2,4.24 36.2,6.35 35.24,7.3 | U$2.13 28.57,8.26 27.62,7.3 | 45.4,7.3 46.35,8.26 46.35,11.3 46.23,11.43 U$2.6 46.35,13.34 47.37,14.35 47.37,16.26 C5.2 C4.2 C10.2 C9.2 C2.2 59.42,18.15 61.04,18.15 R6.2 73.35,20.38 | U$2.20 10.79,8.26 9.84,7.3 | 6.03,7.3 2.54,10.79 2.54,31.43 3.98,32.87 3.98,32.98 | RASPBERRYPI.5 55.52,68.26 | 55.52,68.26 59.69,68.26 60.64,67.31 | RASPBERRYPI.10 60.64,65.77 60.64,67.31 | JP4.1 77.47,67.97 | v33.02,23.5 42.51,23.5 43.62,22.39 C18.- | 73.35,20.38 73.08,20.38 70.96,18.26 GPIO0.1 70.96,14.56 RST.2 70.92,14.17 73.66,11.43 5VUSB.GND | 73.35,20.38 GPIO15.2 | IC1.22 33.48,46.53 C3.2 | IC3.1 7.75,30.85 C20.- | X7.1 73,75.42 | 60.64,67.31 60.83,67.5 68.25,67.5 73,72.25 X7.1 | 55.52,68.26 55.5,68.28
  Top 0.406: T8.3 X7.1
  Bottom 0.406: JP6.1 80.55,27.45 FTDI1.6 | VDB1.1 24.57,55.82 C12.- C19.- | C5.2 48.86,17.78 C18.- | IC1.8 36,38.47 | 36,38.47 36,41 33.66,43.34 IC1.22 | 36,38.47 37.47,37 37.47,33.97 35.56,32.07 C6.2 | GND.1 53.34,28.23 53.34,26.67 56.52,23.5 C9.2 | CN1.GNDBREAK 7.49,75.71 CN1.GND 10.07,74.52 17.22,74.52 17.77,73.98 17.78,73.98 | 17.78,73.98 17.78,71.84 CT1.4 | 30.16,73.98 43.18,73.98 44.16,73 CT3.4 47.09,68.9 52.07,68.9 53.63,67.33 RASPBERRYPI.5 55.5,68.25 X1.3 | 30.16,73.98 17.78,73.98 | CT2.4 31.11,71.89 31.11,73.03 30.16,73.98 | C8.2 58.72,63.77 RASPBERRYPI.10 | R14.1 77.47,47.05 77.5,47.08 JP4.1 JP4.2 76.5,71.54 T8.3 | C7.2 v33.02,23.5 | C22.2 15.37,33.36 C21.- 8.13,33.36 IC3.1
  pour Top: -0.75,79.5 -0.25,-0.25 100.25,-0.25 100.25,80 -0.5,80.5
  pour Bottom: 0,80 0,0 100,0 100,2.75 99.75,80
IRQ
  Top 0.406: R3.2 BACKLIGHT_SJ.2
N$1
  Top 0.406: C6.1 38.1,32.35 16MHZ.2 41.27,35.53 IC1.10
N$2
  Top 0.406: C12.+ 30.92,57.59 VDB2.2 | VDB2.2 VDT2.1 BUR2.1 | VDB2.2 28.33,65.91 CT2.5
N$3
  Top 0.406: C2.1 U$2.1
N$4
  Top 0.406: C9.1 U$2.2
N$5
  Top 0.406: C10.1 U$2.3
N$6
  Top 0.406: C4.1 U$2.4
N$7
  Top 0.406: C14.+ 6.64,57.17 R12.1
N$8
  Top 0.406: VDB3.2 VDT3.1 BUR3.1 | VDB3.2 42.91,57.59 C19.+ | CT3.5 41.46,64.89 VDB3.2
N$9
  Top 0.406: C5.1 U$2.5
N$10
  Top 0.406: U$2.10 42.15,17.39 C15.- 45.53,17.39 C16.-
N$11
  Top 0.406: D1.C 6.08,34.48 IC3.2
  Bottom 0.406: C20.+ 4.57,30.33 5.84,31.6 IC3.2
N$12
  Top 0.406: IC1.9 38.73,38.07 35.58,34.91 16MHZ.1 30.51,29.84 C7.1
N$13
  Top 0.406: T1.1 87.81,61.09 R17.1
  Bottom 0.406: T1.1 92.23,71.61 94,73.38 T9.1
N$14
  Top 0.406: JP1.3 10.26,44.74 7.25,47.75 5.94,47.75 R4.1
N$16
  Top 0.406: T1.3 94.77,65.23 95.5,64.5 95.5,63.41 Q2.2
  Bottom 0.406: Q2.2 93.5,58.5 93,58 92.5,58 90,55.5 90,51.91 R16.2
N$17
  Top 0.406: R3.1 BACKLIGHT.1
N$18
  Top 0.406: T1.2 93.5,63.5 93,63.5 90,60.5 90,56.5 | 90,56.5 88.5,55 R9.1 82.58,49.77 R14.2 | Q1.3 92,54.5 90,56.5
N$19
  Top 0.406: 35.97,48.95 C3.1 36.02,46.53 IC1.21
N$20
  Top 0.406: U$2.11 41.53,19.3 45.47,19.3 48.55,22.39 C16.+
N$21
  Top 0.406: R15.2 85,49.45 85,49 83.5,47.5 81.5,47.5 80,49 80,49.53 R19.1
  Bottom 0.406: Q2.3 90.53,57.61 R11.1 86.11,57.62 85.11,56.62 R15.2
N$22
  Top 0.406: U$2.9 42.92,15.61 C15.+
N$23
  Bottom 0.305: 43.81,12.32 44.7,13.21 49.28,13.21 50.16,14.1 50.16,18.67 52.07,20.57 53.21,20.57
  Bottom 0.406: U$2.7 43.81,12.32 | 53.21,20.57 C17.-
N$24
  Top 0.406: JP1.2 9.09,41.91 6.08,44.92 D1.A
N$25
  Top 0.406: R18.1 93.47,52.53 93.5,52.5 Q1.2
N$26
  Top 0.406: U$1.2 76.91,20.5 GPIO15.1
N$27
  Top 0.305: U$2.8 44.07,14.22 45.34,14.22 46.23,15.11 46.23,17.02 48.51,19.3 50.04,19.3 53.12,22.39
  Top 0.406: 53.12,22.39 C17.+
N$28
  Top 0.406: U$2.12 40.3,20.61 C18.+
N$29
  Top 0.406: U$1.4 74.58,16.5 GPIO0.2
N$31  (via drill 0.5)
  other vias: 28,34
N$32  (via drill 0.5)
  other vias: 20,28
N$33  (via drill 0.5)
  other vias: 20,22
N$34
  Top 0.406: R13.2 VDT.1 VDB.2 14.39,54.75 C13.+
N$35  (via drill 0.5)
  other vias: 5,22
N$36
  Bottom 0.305: FTDI1.3 88.17,24.99 87.31,24.13 69.59,24.13 R5.1
N$37  (via drill 0.5)
  other vias: 5,11
N$38
  Top 0.406: BUR1.1 VDT1.1 VDB1.2 | C11.+ 18,56.86 VDB1.2 | VDB1.2 15.12,66.92 CT1.5
N$39
  Top 0.406: U$1.11 96.95,12.5 97.79,13.34 97.79,25.4 96.72,26.47 CH_PD.1
N$40
  Top 0.305: U$1.9 94.86,8.64 84.07,8.64 82.55,7.11 77.22,7.11 76.96,7.37 76.96,8.92
  Top 0.406: 76.96,8.92 76.96,10.67 73.66,13.97 73.66,14.32 RST.1
N$41  (via drill 0.5)
  other vias: 16,9
N$42  (via drill 0.5)
  other vias: 30.5,9
N$43  (via drill 0.5)
  other vias: 64,11
N$44  (via drill 0.5)
  other vias: 84,5
N$45  (via drill 0.5)
  other vias: 93,5
N$46  (via drill 0.5)
  other vias: 90,39
N$47  (via drill 0.5)
  other vias: 90,47
N$48  (via drill 0.5)
  other vias: 84,60
N$50  (via drill 0.5)
  other vias: 74,68
RESET
  Top 0.406: IC1.1 18.41,38.1 21.27,35.24 21.27,31.11 26.35,26.04 41.27,26.04 42.55,27.3 48.58,27.3 51.12,24.77 60.1,24.77 C1.1
  Bottom 0.406: R1.1 14.57,38.73 IC1.1

### Text on the board
tPlace: Designed in | North Wales | Made in UK | Open-Hardware
bValues: All:
_tsilk: GND RX TX | 3.3V PULSE | GND A3 A4 | 3.3V MBUS | HEATPUMP MONITOR v0.1 (Nov 2015) | An OpenEnergyMonitor project | Technology that helps us live within / ecological limits | Designed in / Snowdonia, North Wales / by Trystan Lea, / Glyn Hudson / & John Cantor | 6x DS18B20 TEMPERATURE SENSOR PORTS | GND DAT 3.3V | GND DAT 3.3V | GND DAT 3.3V | GND DAT 3.3V | GND DAT 3.3V | GND DAT 3.3V